# Altium schematic sheet Host_Controller.SchDoc: Host_Controller
size A4
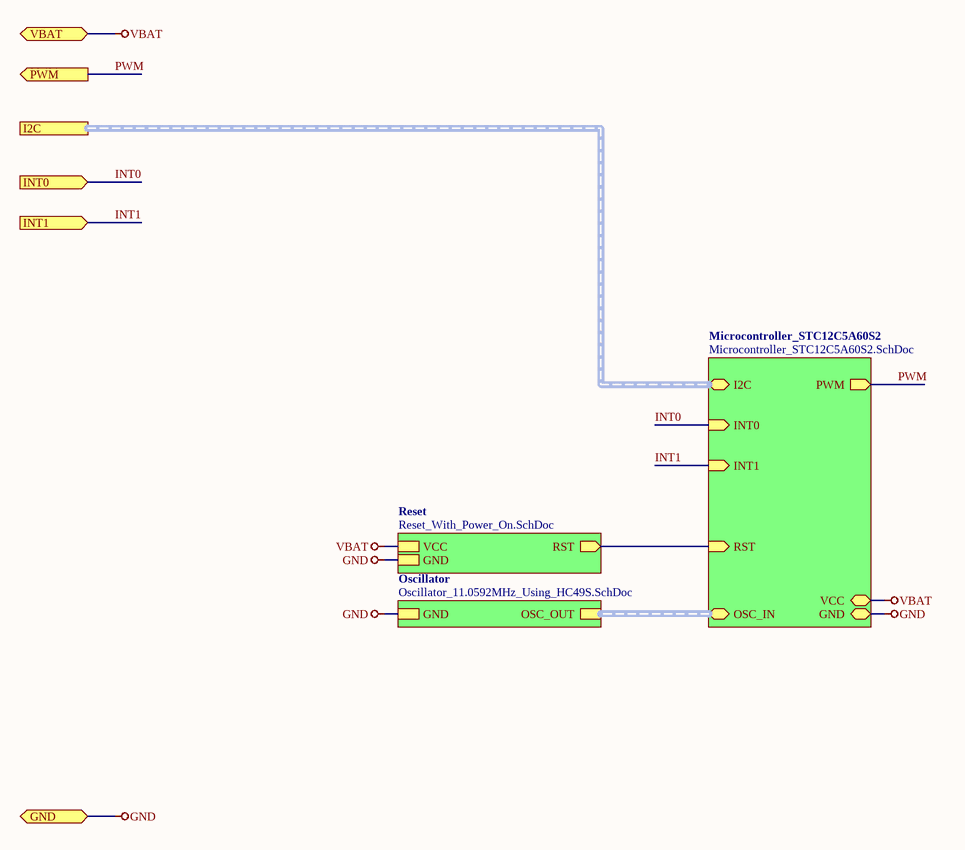
[diagram p0: Host_Controller.SchDoc]

## Sub-sheets
Microcontroller_STC12C5A60S2 = Microcontroller_STC12C5A60S2.SchDoc: OSC_IN (harness CLOCK), RST (in), VCC, GND, PWM (out), I2C (harness I2C), INT0 (in), INT1 (in)
Oscillator = Oscillator_11.0592MHz_Using_HC49S.SchDoc: GND, OSC_OUT (harness OSC)
Reset = Reset_With_Power_On.SchDoc: VCC, GND, RST (out)

## Ports
GND, I2C (harness I2C), INT0 (in), INT1 (in), PWM (out), VBAT

## Nets
GND: port GND, sheet Oscillator/GND, sheet Reset/GND, sheet Microcontroller_STC12C5A60S2/GND
VBAT: port VBAT, sheet Reset/VCC, sheet Microcontroller_STC12C5A60S2/VCC
INT0: port INT0, sheet Microcontroller_STC12C5A60S2/INT0
INT1: port INT1, sheet Microcontroller_STC12C5A60S2/INT1
PWM: port PWM, sheet Microcontroller_STC12C5A60S2/PWM
(unnamed): sheet Reset/RST, sheet Microcontroller_STC12C5A60S2/RST

## Buses and harness runs
harness port I2C = sheet Microcontroller_STC12C5A60S2/I2C
harness sheet Microcontroller_STC12C5A60S2/OSC_IN = sheet Oscillator/OSC_OUT